# Altium schematic sheet Tape Detection.SchDoc
size A
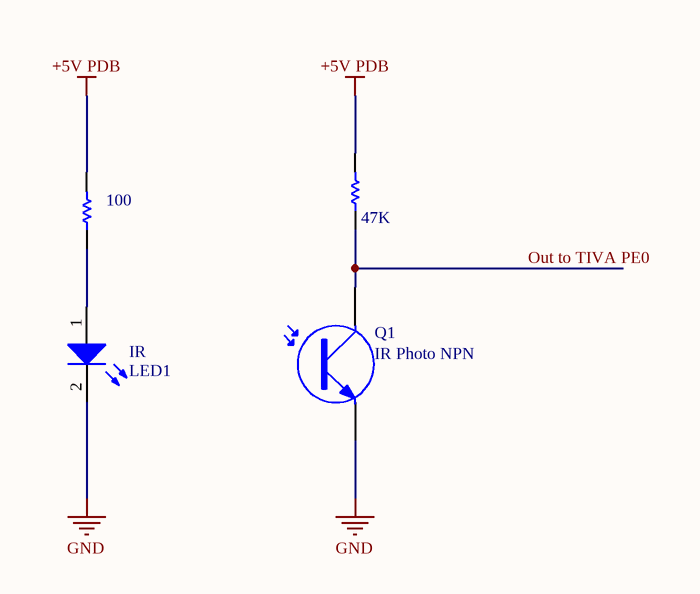
[diagram p0: Tape Detection.SchDoc]

## Parts
(Parts that share a designator on the sheet are numbered #1, #2 ... from top to bottom, then left to right.)
IR  LED1  [LED-0]
Q1  IR Photo NPN  [SFM-T2(3)/X1.6V]
R?#1  value 47K  [AXIAL-0.3]  (hidden comment: Res1)
R?#2  value 100  [AXIAL-0.3]  (hidden comment: Res1)

## Nets
+5V PDB: R?#1.2 R?#2.2
GND: IR.2(K) Q1.3(E)
Out to TIVA PE0: Q1.1(C) R?#1.1
NetIR_1: IR.1(A) R?#2.1

## Library data of the parts
IR = LED0: Typical INFRARED GaAs LED; Manufacturer: Generic Components; Class: Optoelectronic; Published: 08/06/2000; Publisher: Altium Hobart Technology Centre; SubClass: LED
Q1 = Photo NPN: NPN Phototransistor; Manufacturer: Generic Components; Class: Optoelectronic; Published: 1999
R?#1 R?#2 = Res1: Resistor; Manufacturer: Generic Components; Class: Passive; Published: 08/06/2000; Publisher: Altium Hobart Technology Centre; SubClass: Resistor